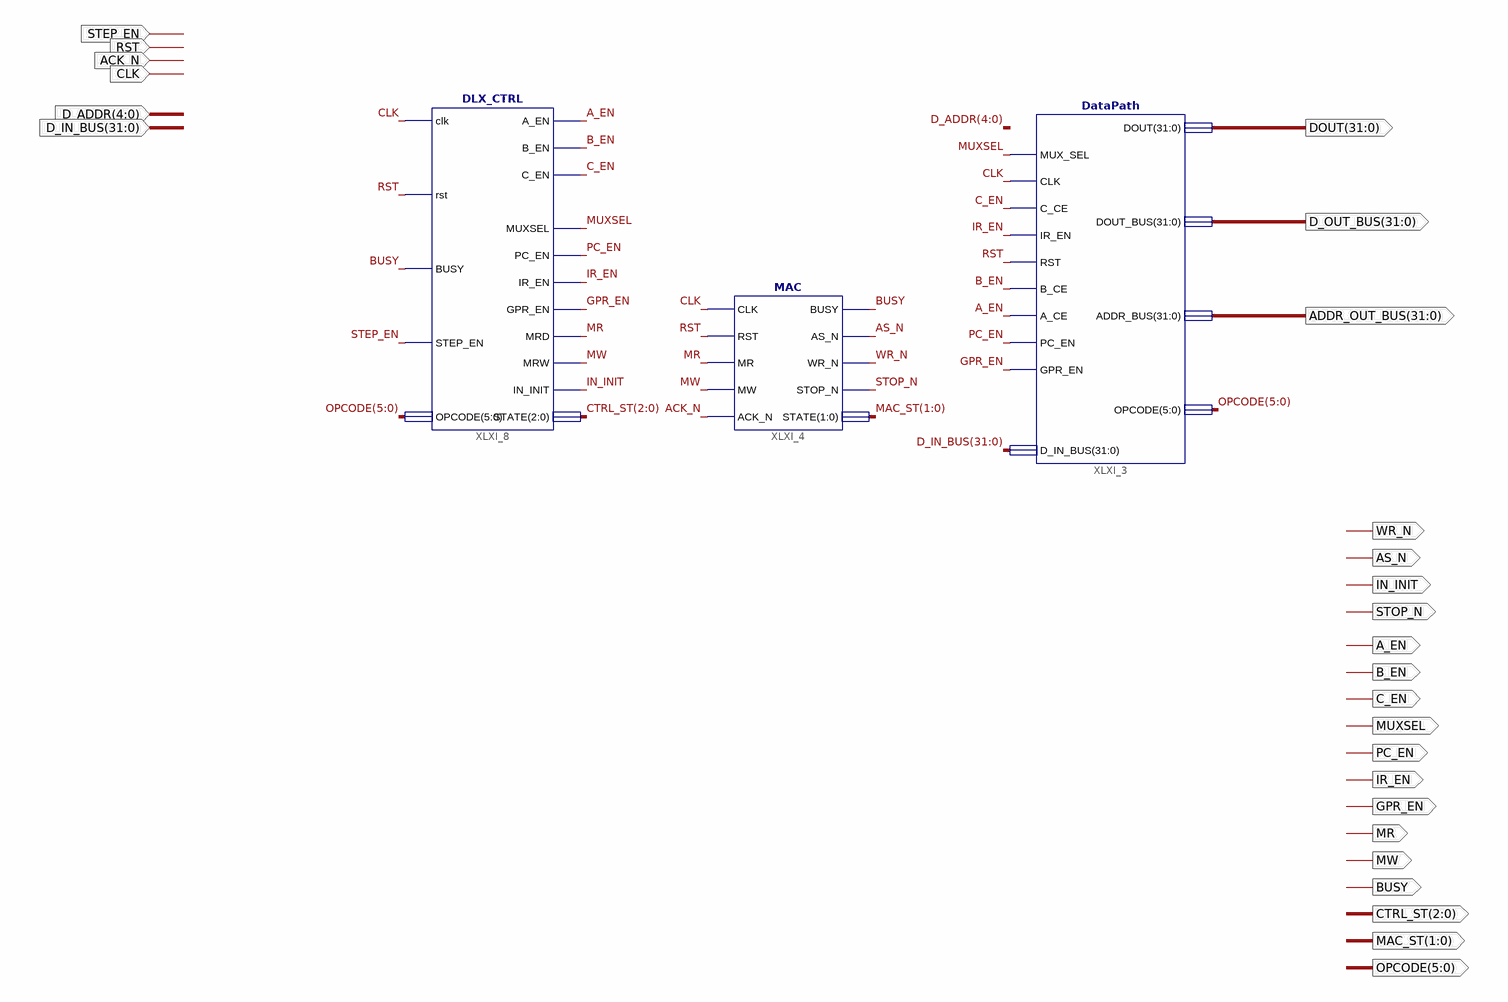
[diagram p0: schematic sheet 1]
// Xilinx ISE schematic LoadStoreMac.sch (spartan6) as structural Verilog: 3 symbols, 26 ports
module LoadStoreMac (
  input  CLK,
  input  RST,
  input  ACK_N,
  input  STEP_EN,
  input  [4:0] D_ADDR,
  input  [31:0] D_IN_BUS,
  output BUSY,
  output [5:0] OPCODE,
  output IN_INIT,
  output MW,
  output MR,
  output GPR_EN,
  output PC_EN,
  output MUXSEL,
  output C_EN,
  output B_EN,
  output A_EN,
  output IR_EN,
  output [31:0] DOUT,
  output [31:0] D_OUT_BUS,
  output [31:0] ADDR_OUT_BUS,
  output AS_N,
  output WR_N,
  output STOP_N,
  output [2:0] CTRL_ST,
  output [1:0] MAC_ST
);

  DataPath XLXI_3 (
    .MUX_SEL(MUXSEL), .CLK(CLK), .C_CE(C_EN), .IR_EN(IR_EN), .RST(RST), .B_CE(B_EN), .A_CE(A_EN),
    .PC_EN(PC_EN), .GPR_EN(GPR_EN), .D_ADDR(D_ADDR), .DOUT(DOUT), .DOUT_BUS(D_OUT_BUS),
    .ADDR_BUS(ADDR_OUT_BUS), .OPCODE(OPCODE), .D_IN_BUS(D_IN_BUS));
  MAC XLXI_4 (
    .CLK(CLK), .RST(RST), .MR(MR), .MW(MW), .ACK_N(ACK_N), .BUSY(BUSY), .AS_N(AS_N), .WR_N(WR_N),
    .STOP_N(STOP_N), .STATE(MAC_ST));
  DLX_CTRL XLXI_8 (
    .clk(CLK), .rst(RST), .BUSY(BUSY), .STEP_EN(STEP_EN), .OPCODE(OPCODE), .A_EN(A_EN), .B_EN(B_EN),
    .C_EN(C_EN), .MUXSEL(MUXSEL), .PC_EN(PC_EN), .IR_EN(IR_EN), .GPR_EN(GPR_EN), .MRD(MR), .MRW(MW),
    .IN_INIT(IN_INIT), .STATE(CTRL_ST));
endmodule
